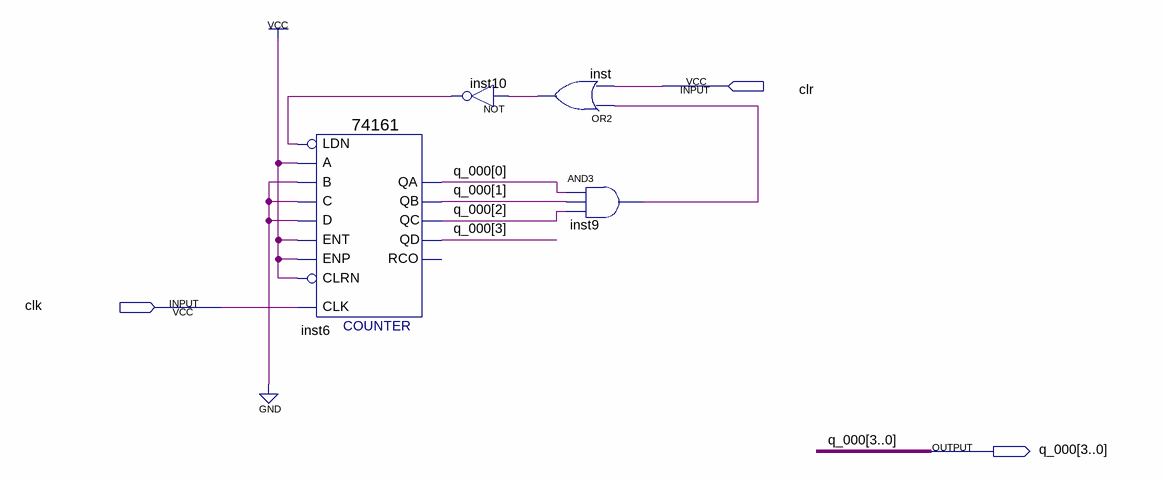
[diagram p0: schematic sheet]
// Quartus schematic cnt7.bdf as structural Verilog: 4 symbols, 3 pins
module cnt7 (
  input  clr,
  input  clk,
  output [3:0] q_000
);

  wire inst9_out, inst10_out, inst_out;

  \74161  inst6 (
    .CLRN(1'b1), .CLK(clk), .ENP(1'b1), .LDN(inst10_out), .A(1'b1), .D(1'b0), .ENT(1'b1), .B(1'b0), .C(1'b0),
    .QD(q_000[3]), .QC(q_000[2]), .QB(q_000[1]), .QA(q_000[0]));  // open: RCO
  not inst10 (inst10_out, inst_out);
  or inst (inst_out, inst9_out, clr);
  and inst9 (inst9_out, q_000[0], q_000[1], q_000[2]);
endmodule
